# Altium schematic sheet bbr18_wheel_motor_connector_mate_board.SchDoc
size A4
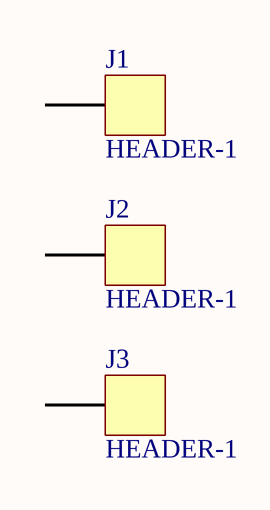
[diagram p0: bbr18_wheel_motor_connector_mate_board.SchDoc]

## Parts
J1  HEADER-1  [2MM-BANANA-VIA]
J2  HEADER-1  [2MM-BANANA-VIA]
J3  HEADER-1  [2MM-BANANA-VIA]

## Nets

Not connected (* = marked no-connect by the designer): J1 1; J2 1; J3 1